# EAGLE design MP2225 (EAGLE 9.4.2)
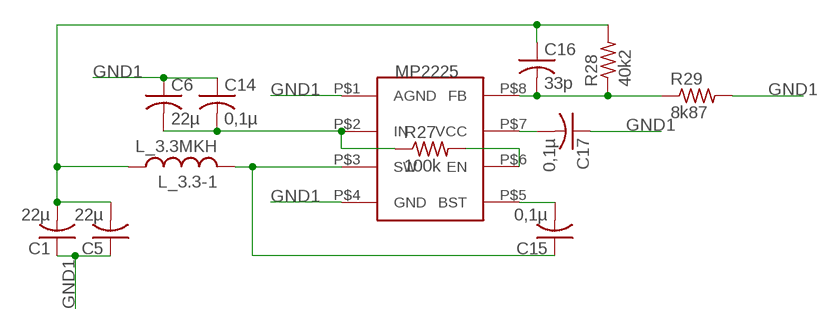
[diagram p0: schematic, sheet 1]

## Parts
C1  22µ  C-USC1206  [C1206]
C5  22µ  C-USC1206  [C1206]
C6  22µ  C-USC1206  [C1206]
C14  0,1µ  C-USC0603  [C0603]
C15  0,1µ  C-USC0603  [C0603]
C16  33p  C-USC0603  [C0603]
C17  0,1µ  C-USC0603  [C0603]
L_3.3-1  L_3.3MKH  L_3.3MKH_5X5  [L_SPM5020]
MP2225-1  MP2225  [TSOT23-8]
R27  100k  R-US_R0603  [R0603]
R28  40k2  R-US_R0603  [R0603]
R29  8k87  R-US_R0603  [R0603]

## Nets
GND1: C1.1 C5.1 C6.1 C14.1 C17.1 MP2225-1.P$1(AGND) MP2225-1.P$4(GND) R29.2
N$2: C1.2 C5.2 C16.1 L_3.3-1.P$1 R28.2
N$7: C6.2 C14.2 MP2225-1.P$2(IN) R27.1
N$8: C15.1 L_3.3-1.P$2 MP2225-1.P$3(SW)
N$9: C15.2 MP2225-1.P$5(BST)
N$10: MP2225-1.P$6(EN) R27.2
N$12: C17.2 MP2225-1.P$7(VCC)
N$22: C16.2 MP2225-1.P$8(FB) R28.1 R29.1

## Library data of the parts
C1 C5 C6 C14-C17 = rcl:C-US: CAPACITOR, American symbol; SPICEPREFIX: C
L_3.3-1 = CanCubeSat:L_3.3MKH_5X5
MP2225-1 = CanCubeSat:MP2225
R27-R29 = resistor:R-US_: RESISTOR, American symbol

## Board
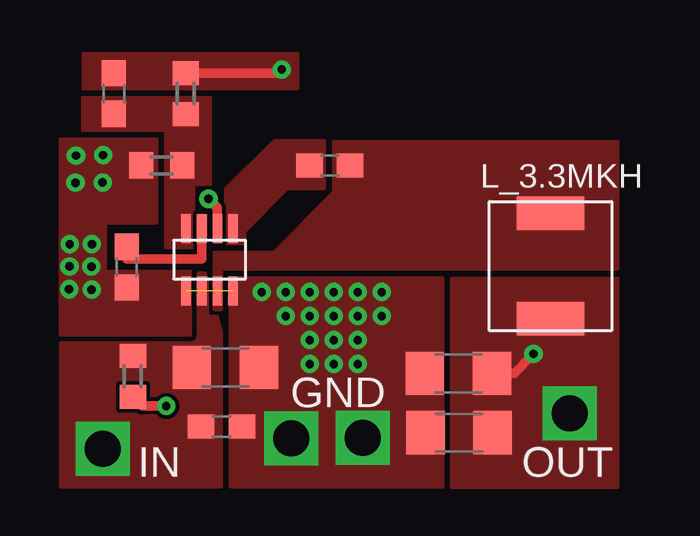
[diagram p1: board, top side]
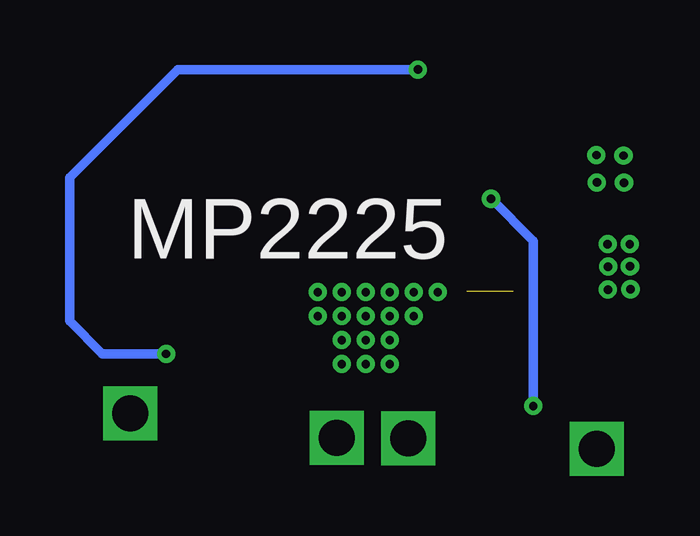
[diagram p2: board, bottom side, seen from below]

No outline drawn. Coordinates in mm, seen from the top.
Copper layers (1*16): Top 0.035mm / dielectric 1.5mm / Bottom 0.035mm
Design rules "default": minimum track width 6mil, minimum drill 0.35mm, track to track 6mil, track to pad 6mil, pad to pad 6mil, via to via 6mil, smd to smd 6mil, copper to edge 40mil, drill to drill 6mil, minimum pad ring 10mil, minimum via ring 8mil, stop-mask expansion 4mil, vias tented up to drill 0mil, thermal gap 10mil

### Footprints (pad centres in the part's own frame; a part is rotated, then mirrored left to right if it is on the bottom)
C1206 = smd 1.6 x 1.8: 1 -1.4,0; 2 1.4,0
C0603 = smd 1.1 x 1: 1 -0.85,0; 2 0.85,0
L_SPM5020 = smd 1.4 x 2.8: P$1 -2.2,0; P$2 2.2,0
TSOT23-8 = smd 0.4 x 1.2: P$1 -0.975,-1.3; P$2 -0.325,-1.3; P$3 0.325,-1.3; P$4 0.975,-1.3; P$5 0.975,1.3; P$6 0.325,1.3; P$7 -0.325,1.3; P$8 -0.975,1.3
R0603 = smd 1 x 1.1: 1 -0.85,0; 2 0.85,0

### Placement (x,y rotation side)
C1  18.76,6.47 0 top
C5  18.73,8.94 0 top
C6  9.02,9.19 180 top
C14  8.86,6.72 180 top
C15  13.37,17.61 180 top
C16  4.37,20.61 270 top
C17  4.92,13.37 90 top
L_3.3-1  22.57,13.41 90 top
MP2225-1  8.37,13.68 0 top
R27  5.17,8.81 270 top
R28  7.37,20.61 90 top
R29  6.37,17.61 180 top

### Tracks (layer width: path | path; a pad name or v marks a point on that pad's centre or on a via)
GND1  (via drill 0.35, 1.5)  (1 unrouted)
  other vias: 2.8,18.02 3.93,18.04 2.78,16.89 3.91,16.9 2.54,14.33 3.46,14.33 2.53,13.4 3.44,13.39 2.51,12.45 3.45,12.43 10.54,12.33 11.54,12.33 12.54,12.33 13.54,12.33 14.54,12.33 15.54,12.33 11.54,11.33 12.54,11.33 13.54,11.33 14.54,11.33 15.54,11.33 12.54,10.33 13.54,10.33 14.54,10.33 12.54,9.33 13.54,9.33 14.54,9.33 11.76,6.23 14.75,6.25
  pour Top (no thermals): 9.23,12.91 9.23,4.21 18.07,4.21 18.07,12.91
  pour Top (no thermals): 7.55,13.18 7.55,10.55 2.14,10.55 2.14,18.7 6.16,18.7 6.16,15.2 4.02,15.2 4.02,13.18
N$2  (via drill 0.35, 1.5)
  Top 0.4: R28.2 11.22,21.46 v11.37,21.61 | v21.86,9.75 21.05,8.94 C5.2
  Bottom 0.4: v11.37,21.61 21.37,21.61 25.88,17.1 25.88,11.12 24.51,9.75 v21.86,9.75
  other vias: 23.36,7.27
  pour Top (no thermals): 18.46,12.89 25.37,12.89 25.37,4.18 18.46,4.18
  pour Top (no thermals): 3.1,20.81 3.1,22.26 12.02,22.26 12.03,22.25 12.03,20.81
N$7  (via drill 1.5)
  other vias: 3.92,5.79
  pour Top (rank 2, no thermals): 7.89,13.13 8.16,13.13 8.85,10.66 8.85,4.21 2.16,4.21 2.16,10.2 7.66,10.2 7.89,10.43
N$8
  pour Top (no thermals): 8.56,11.61 8.56,13.98 11.03,13.98 13.54,16.49 13.54,18.61 25.37,18.61 25.37,13.3 8.86,13.3 8.86,11.61
N$9
  pour Top (no thermals): 9.04,14.36 9.04,16.64 11.05,18.65 13.13,18.65 13.14,18.64 13.14,16.64 11.61,16.64 9.82,14.85 9.82,14.36
N$10  (via drill 0.35)
  Top 0.4: MP2225-1.P$6 8.69,15.85 v8.32,16.22 | v6.56,7.58 5.55,7.58 R27.2
  Bottom 0.4: v8.32,16.22 6.56,14.46 v6.56,7.58
N$12
  Top 0.4: C17.2 4.92,13.71 8.05,13.71 8.05,15.02 MP2225-1.P$7
N$22
  pour Top (no thermals): 7.71,14.18 6.53,14.18 6.53,19.08 3.08,19.08 3.08,20.43 8.4,20.43 8.4,16.81 7.71,16.81

### Text on the board
tNames: GND | IN | OUT
bNames: MP2225